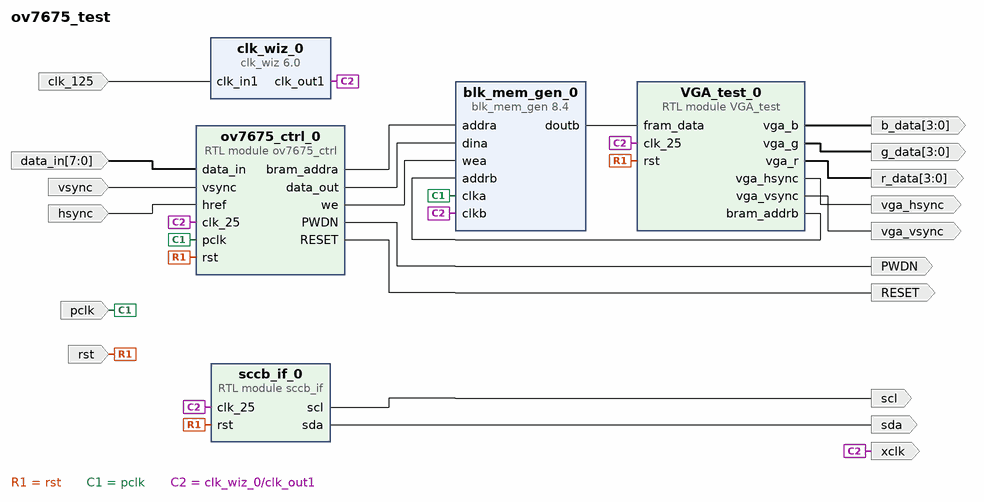
[diagram p0: block diagram of the top level]
# Vivado block design ov7675_test, xc7z020clg400-1, Vivado 2019.1
create_bd_design ov7675_test

create_bd_port -dir I -type clk clk_125
set_property -dict {CONFIG.FREQ_HZ 125000000} [get_bd_ports clk_125]
create_bd_port -dir I rst
create_bd_port -dir O vga_vsync
create_bd_port -dir O vga_hsync
create_bd_port -dir O -from 3 -to 0 g_data
create_bd_port -dir O -from 3 -to 0 r_data
create_bd_port -dir O -from 3 -to 0 b_data
create_bd_port -dir I -from 7 -to 0 data_in
create_bd_port -dir I pclk
create_bd_port -dir I vsync
create_bd_port -dir I hsync
create_bd_port -dir O xclk
create_bd_port -dir O scl
create_bd_port -dir O -type data sda
create_bd_port -dir O RESET
create_bd_port -dir O PWDN

create_bd_cell -type ip -vlnv xilinx.com:ip:blk_mem_gen:8.4 blk_mem_gen_0
set_property -dict [list \
  CONFIG.Enable_32bit_Address false \
  CONFIG.Enable_A Always_Enabled \
  CONFIG.Enable_B Always_Enabled \
  CONFIG.Memory_Type Simple_Dual_Port_RAM \
  CONFIG.Operating_Mode_A NO_CHANGE \
  CONFIG.Port_B_Clock 100 \
  CONFIG.Port_B_Enable_Rate 100 \
  CONFIG.Read_Width_B 16 \
  CONFIG.Register_PortB_Output_of_Memory_Primitives true \
  CONFIG.Use_Byte_Write_Enable false \
  CONFIG.Write_Depth_A 76800 \
  CONFIG.Write_Width_A 16 \
  CONFIG.Write_Width_B 16 \
  CONFIG.use_bram_block Stand_Alone \
] [get_bd_cells blk_mem_gen_0]
create_bd_cell -type ip -vlnv xilinx.com:ip:clk_wiz:6.0 clk_wiz_0
set_property -dict [list \
  CONFIG.CLKIN1_JITTER_PS 80.0 \
  CONFIG.CLKOUT1_JITTER 312.659 \
  CONFIG.CLKOUT1_PHASE_ERROR 245.713 \
  CONFIG.CLKOUT1_REQUESTED_OUT_FREQ 25.000 \
  CONFIG.CLKOUT2_JITTER 143.688 \
  CONFIG.CLKOUT2_PHASE_ERROR 96.948 \
  CONFIG.CLKOUT2_REQUESTED_OUT_FREQ 50.000 \
  CONFIG.CLKOUT2_USED false \
  CONFIG.MMCM_CLKFBOUT_MULT_F 36.500 \
  CONFIG.MMCM_CLKIN1_PERIOD 8.000 \
  CONFIG.MMCM_CLKOUT0_DIVIDE_F 36.500 \
  CONFIG.MMCM_CLKOUT1_DIVIDE 1 \
  CONFIG.MMCM_DIVCLK_DIVIDE 5 \
  CONFIG.NUM_OUT_CLKS 1 \
  CONFIG.PRIM_IN_FREQ 125.000 \
  CONFIG.USE_LOCKED false \
  CONFIG.USE_RESET false \
] [get_bd_cells clk_wiz_0]
create_bd_cell -type module -reference VGA_test VGA_test_0
create_bd_cell -type module -reference ov7675_ctrl ov7675_ctrl_0
create_bd_cell -type module -reference sccb_if sccb_if_0

# ---- connections ----

connect_bd_net -net clk_125_1 [get_bd_ports clk_125] [get_bd_pins clk_wiz_0/clk_in1]
connect_bd_net [get_bd_ports rst] [get_bd_pins VGA_test_0/rst] [get_bd_pins ov7675_ctrl_0/rst] [get_bd_pins sccb_if_0/rst]
connect_bd_net [get_bd_pins VGA_test_0/vga_vsync] [get_bd_ports vga_vsync]
connect_bd_net [get_bd_pins VGA_test_0/vga_hsync] [get_bd_ports vga_hsync]
connect_bd_net [get_bd_pins VGA_test_0/vga_b] [get_bd_ports b_data]
connect_bd_net [get_bd_pins VGA_test_0/vga_g] [get_bd_ports g_data]
connect_bd_net [get_bd_pins VGA_test_0/vga_r] [get_bd_ports r_data]
connect_bd_net [get_bd_ports data_in] [get_bd_pins ov7675_ctrl_0/data_in]
connect_bd_net [get_bd_ports vsync] [get_bd_pins ov7675_ctrl_0/vsync]
connect_bd_net [get_bd_ports hsync] [get_bd_pins ov7675_ctrl_0/href]
connect_bd_net [get_bd_ports pclk] [get_bd_pins ov7675_ctrl_0/pclk] [get_bd_pins blk_mem_gen_0/clka]
connect_bd_net [get_bd_pins ov7675_ctrl_0/bram_addra] [get_bd_pins blk_mem_gen_0/addra]
connect_bd_net -net ov7675_ctrl_0_rgb_out [get_bd_pins ov7675_ctrl_0/data_out] [get_bd_pins blk_mem_gen_0/dina]
connect_bd_net [get_bd_pins ov7675_ctrl_0/we] [get_bd_pins blk_mem_gen_0/wea]
connect_bd_net [get_bd_pins VGA_test_0/bram_addrb] [get_bd_pins blk_mem_gen_0/addrb]
connect_bd_net [get_bd_pins blk_mem_gen_0/doutb] [get_bd_pins VGA_test_0/fram_data]
connect_bd_net [get_bd_pins sccb_if_0/scl] [get_bd_ports scl]
connect_bd_net [get_bd_pins sccb_if_0/sda] [get_bd_ports sda]
connect_bd_net [get_bd_pins ov7675_ctrl_0/PWDN] [get_bd_ports PWDN]
connect_bd_net [get_bd_pins ov7675_ctrl_0/RESET] [get_bd_ports RESET]
connect_bd_net [get_bd_pins clk_wiz_0/clk_out1] \
  [get_bd_pins ov7675_ctrl_0/clk_25] [get_bd_pins VGA_test_0/clk_25] [get_bd_pins blk_mem_gen_0/clkb] [get_bd_ports xclk] \
  [get_bd_pins sccb_if_0/clk_25]

validate_bd_design
save_bd_design
